# Altium schematic sheet MCU.SchDoc
size A
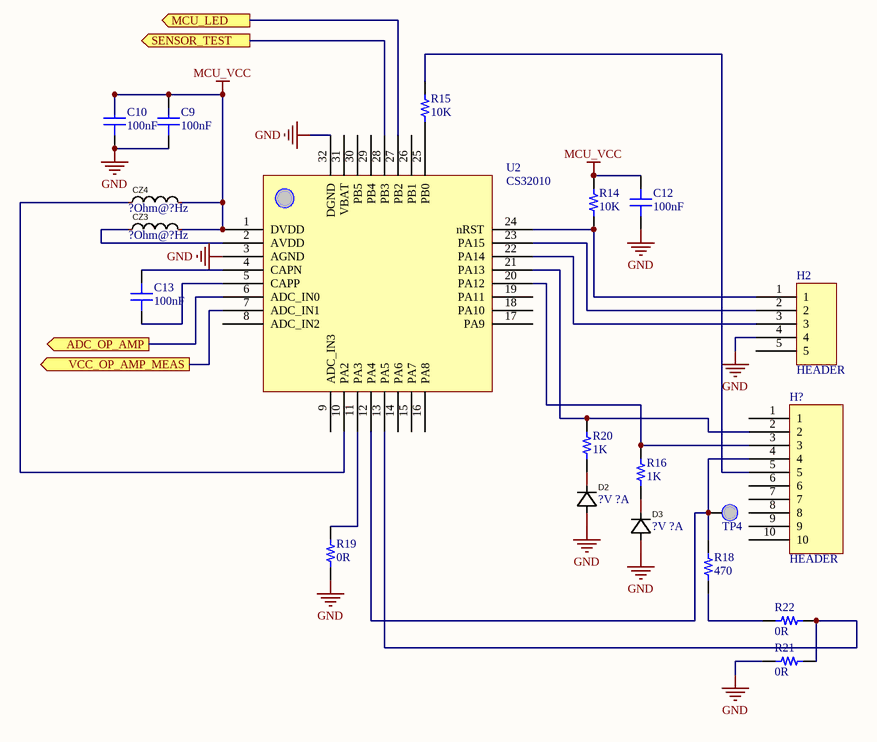
[diagram p0: MCU.SchDoc]

## Parts
C9  100nF  [0603_C]
C10  100nF  [0603_C]
C12  100nF  [0603_C]
C13  100nF  [0603_C]
CZ3  ?Ohm@?Hz  [L0603]
CZ4  ?Ohm@?Hz  [L0603]
D2  ?V ?A
D3  ?V ?A
H2  HEADER
H?  HEADER
R14  10K  [0402_R]
R15  10K  [0402_R]
R16  1K  [0402_R]
R18  470  [0402_R]
R19  0R  [0402_R]
R20  1K  [0402_R]
R21  0R  [0402_R]
R22  0R  [0402_R]
TP4  TP  (value not drawn)
U2  CS32010  (net tie)

## Ports
ADC_OP_AMP (out), MCU_LED (out), SENSOR_TEST (out), VCC_OP_AMP_MEAS (out)

## Nets
GND: C9.1 C10.1 C12.1 D2.2(A) D3.2(A) H2.4 R19.1 R21.2 U2.3(AGND) U2.32(DGND)
MCU_VCC: C9.2 C10.2 C12.2 CZ3.2 CZ4.2 R14.2 U2.1(DVDD)
ADC_OP_AMP: U2.6(ADC_IN0) ; port ADC_OP_AMP
MCU_LED: U2.27(PB2) ; port MCU_LED
SENSOR_TEST: U2.28(PB3) ; port SENSOR_TEST
VCC_OP_AMP_MEAS: U2.7(ADC_IN1) ; port VCC_OP_AMP_MEAS
NetC13_1: C13.1 U2.5(CAPP)
NetC13_2: C13.2 U2.4(CAPN)
NetCZ3_1: CZ3.1 U2.2(AVDD)
NetCZ4_1: CZ4.1 U2.10(PA2)
NetD2_1: D2.1(K) R20.1
NetD3_1: D3.1(K) R16.1
NetH2_1: H2.1 R14.1 U2.24(nRST)
NetH2_2: H2.2 U2.23(PA15)
NetH2_3: H2.3 U2.22(PA14)
NetH?_2: H?.2 R20.2 U2.21(PA13)
NetH?_3: H?.3 R16.2 U2.20(PA12)
NetH?_4: H?.4 R18.2 TP4.8 U2.12(PA4)
NetH?_5: H?.5 R15.1
NetR15_2: R15.2 U2.25(PB0)
NetR18_1: R18.1 R22.2
NetR19_2: R19.2 U2.11(PA3)
NetR21_1: R21.1 R22.1 U2.13(PA5)

Not connected (* = marked no-connect by the designer): H2 5; H? 1 6 7 8 9 10; U2 8(ADC_IN2) 9(ADC_IN3) 14(PA6) 15(PA7) 16(PA8) 17(PA9) 18(PA10) 19(PA11) 26(PB1) 29(PB4) 30(PB5) 31(VBAT)

## Library data of the parts
C9 C10 C12 C13 = C0603: SMT Capacitor
CZ3 CZ4 = Bead: Common Smd Bead; Manufacturer: muRata(村田); Name: BLM18AG601SN1D; Add into BOM: yes; Impedance @ Frequency: 600Ω@100MHz; Tolerance: ±25%; DC Resistance: 380mΩ; Current Rating: 500mA; Circuits: 1; Symbol: BLM18AG601SN1D; Device: BLM18AG601SN1D; LCSC Part Name: 单路 0603磁珠 阻抗600Ω@100MHz; Supplier Part: C19330; Manufacturer Part: BLM18AG601SN1D; Supplier Footprint: 0603; JLCPCB Part Class: Extended Part; Datasheet: https://atta.szlcsc.com/upload/public/pdf/source/20180326/C19330_93F4AC33FF94C8E22511353688ADC0FA.pdf; Supplier: LCSC; Convert to PCB: yes
D2 D3 = Diode: Manufacturer: TWGMC(台湾迪嘉); Name: 1N4007; Symbol: 1N4007_C727081; Add into BOM: yes; Forward Voltage (Vf@If): 1.1V 1A; Reverse Leakage Current: 5uA 1kV; Reverse Voltage (Vr): 1kV; Diode Configuration: 独立式; Average Rectified Current (Io): 1A; Device: 1N4007_C727081; LCSC Part Name: 1N4007; Supplier Part: C727081; Manufacturer Part: 1N4007; Supplier Footprint: SMA(DO-214AC); JLCPCB Part Class: Extended Part; Datasheet: https://atta.szlcsc.com/upload/public/pdf/source/20200828/C727079_3A05254382567072883400655AE0ED46.pdf; Supplier: LCSC; Convert to PCB: yes
H2 = HEADER 5: 2.54mm spacing HEADER
H? = HEADER 10: 2.54mm spacing HEADER
R14-R16 R18-R22 = R0402: SMT Resistor
TP4 = TP: Test Point
U2 = CS32010: ChipSea Microcontroller